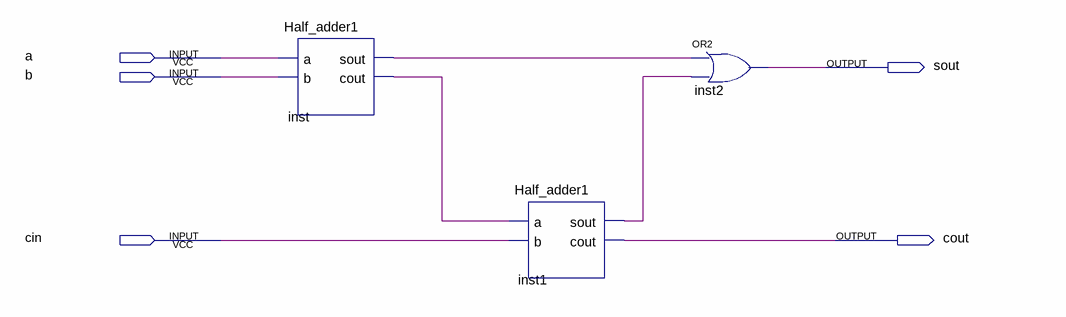
[diagram p0: schematic sheet]
// Quartus schematic Full_adder1.bdf as structural Verilog: 3 symbols, 5 pins
module Full_adder1 (
  input  a,
  input  b,
  input  cin,
  output sout,
  output cout
);

  wire inst1_sout, inst_cout, inst_sout;

  Half_adder1 inst (.a(a), .b(b), .sout(inst_sout), .cout(inst_cout));
  Half_adder1 inst1 (.a(inst_cout), .b(cin), .sout(inst1_sout), .cout(cout));
  or inst2 (sout, inst_sout, inst1_sout);
endmodule
